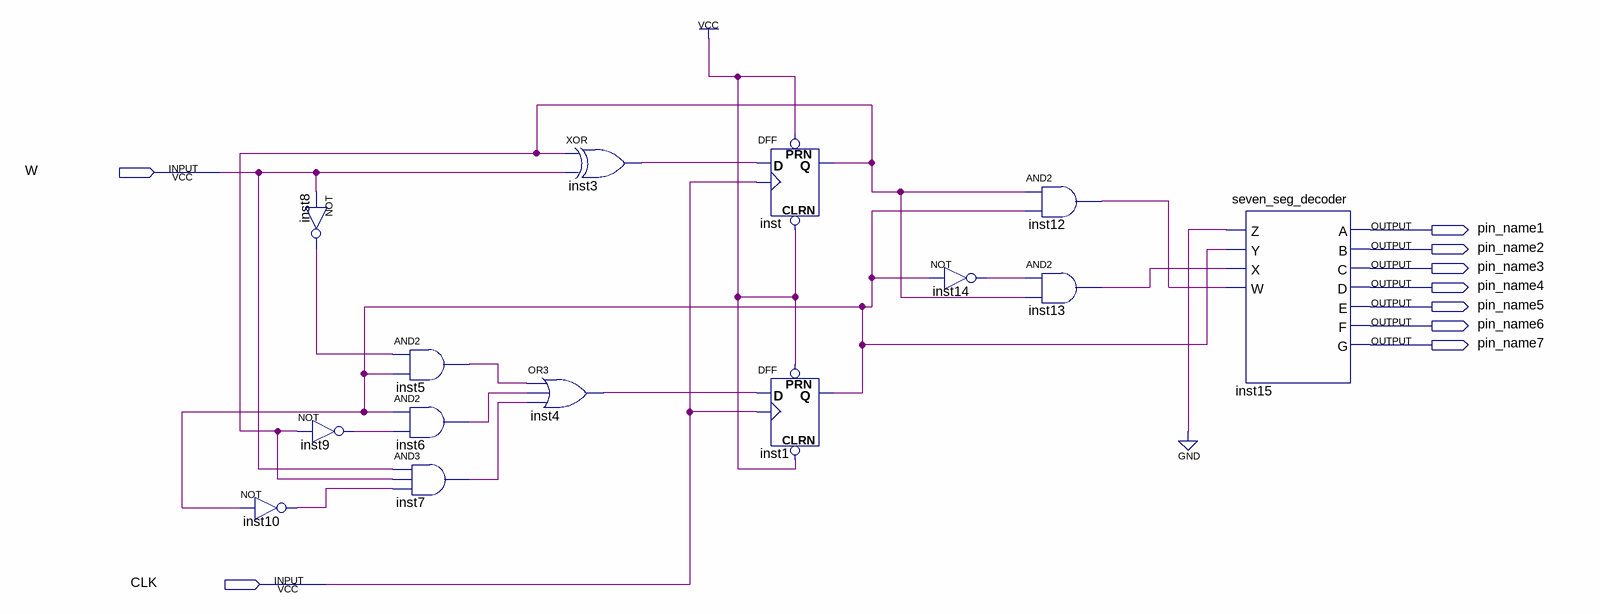
[diagram p0: schematic sheet]
// Quartus schematic step2.bdf as structural Verilog: 14 symbols, 9 pins
module step2 (
  input  W,
  input  CLK,
  output pin_name1,
  output pin_name2,
  output pin_name3,
  output pin_name4,
  output pin_name5,
  output pin_name6,
  output pin_name7
);

  wire inst1_q, inst3_out, inst4_out, inst5_out, inst6_out, inst7_out, inst8_out, inst9_out, inst10_out,
       inst12_out, inst13_out, inst14_out, inst_q;

  not inst10 (inst10_out, inst1_q);
  not inst8 (inst8_out, W);
  not inst9 (inst9_out, inst_q);
  and inst5 (inst5_out, inst8_out, inst1_q);
  and inst6 (inst6_out, inst1_q, inst9_out);
  and inst7 (inst7_out, W, inst_q, inst10_out);
  xor inst3 (inst3_out, inst_q, W);
  or inst4 (inst4_out, inst5_out, inst6_out, inst7_out);
  DFF inst (.CLRN(1'b1), .CLK(CLK), .D(inst3_out), .PRN(1'b1), .Q(inst_q));
  DFF inst1 (.CLRN(1'b1), .CLK(CLK), .D(inst4_out), .PRN(1'b1), .Q(inst1_q));
  not inst14 (inst14_out, inst1_q);
  and inst12 (inst12_out, inst_q, inst1_q);
  and inst13 (inst13_out, inst14_out, inst_q);
  seven_seg_decoder inst15 (
    .Z(1'b0), .Y(inst1_q), .X(inst13_out), .W(inst12_out), .A(pin_name1), .B(pin_name2), .C(pin_name3),
    .D(pin_name4), .E(pin_name5), .F(pin_name6), .G(pin_name7));
endmodule
